# Altium schematic sheet LM27761DSGR.SchDoc
size A4
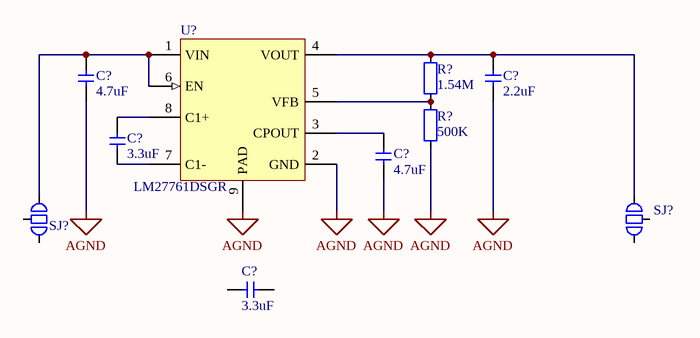
[diagram p0: LM27761DSGR.SchDoc]

## Parts
(Parts that share a designator on the sheet are numbered #1, #2 ... from top to bottom, then left to right.)
C?#1  4.7uF  [C0402]
C?#2  2.2uF  [C0402]
C?#3  4.7uF  [C0402]
C?#4  3.3uF  [C0402]
C?#5  3.3uF  [C0402]
R?#1  1.54M  [R0402]
R?#2  500K  [R0402]
SJ?#1  SJ_3P  [SJ_3P_MINI]  (value not drawn)
SJ?#2  SJ_3P  [SJ_3P_MINI]  (value not drawn)
U?  LM27761DSGR  [TI WSON-8 2x2mm]

## Nets
AGND: C?#1.2 C?#2.2 C?#3.2 R?#2.1 U?.2(GND) U?.9(PAD)
NetC?#1_1: C?#1.1 SJ?#1.1 U?.1(VIN) U?.6(EN)
NetC?#2_1: C?#2.1 R?#1.1 SJ?#2.3 U?.4(VOUT)
NetC?#3_1: C?#3.1 U?.3(CPOUT)
NetC?#4_1: C?#4.1 U?.7(C1-)
NetC?#4_2: C?#4.2 U?.8(C1+)
NetR?#1_2: R?#1.2 R?#2.2 U?.5(VFB)

Not connected (* = marked no-connect by the designer): C?#5 1 2; SJ?#1 2 3; SJ?#2 1 2

## Library data of the parts
C?#1-C?#5 = CAP: Capacitor; Value: 0.1u
R?#1 R?#2 = RES: Resistor; Value: 22R
SJ?#1 SJ?#2 = SJ_3P: 焊接跳线二选一
U? = LM27761DSGR: Low-Noise, Regulated, Switched-Capacitor Voltage Inverter / 2.7-5.5V to -1.5-5V; Part Number: ADP1708; Manufacturer: Analog Devices; Manufacturer Part Number: ADP1708ACPZ-R7; Part number IPS: 00000004966; Value: ADP1708; Artikkelnr Noca: N.A.; Pad Count: 9; ComponentLink1URL: https://www.analog.com/media/en/technical-documentation/data-sheets/ADP1708.pdf; ComponentLink1Description: Datasheet; ComponentLink2URL: https://www.digikey.no/product-detail/no/analog-devices-inc/ADP1708ACPZ-R7/ADP1708ACPZ-R7CT-ND/2467500; ComponentLink2Description: Supplier link; HelpURL: https://www.analog.com/en/products/adp1708.html; Footprint Doc: UDFN-8; LatestRevisionDate: 2020-02-25; Pin Count: 9; Publisher: Nordic Semiconductor; Published: 2020-02-25; Component Class: Misc_ICs; PartId: 101900609